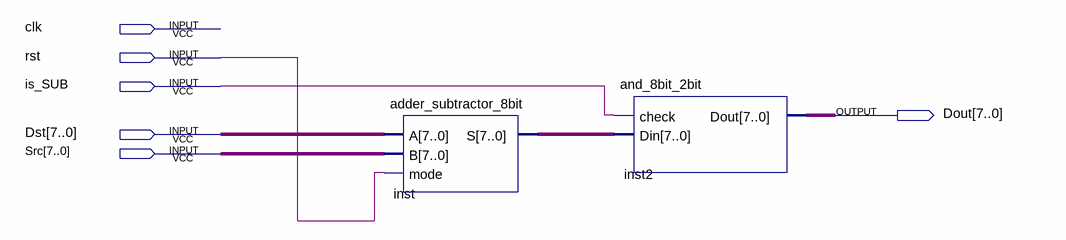
[diagram p0: schematic sheet]
// Quartus schematic sub_module.bdf as structural Verilog: 2 symbols, 6 pins
module sub_module (
  input  clk,
  input  rst,
  input  is_SUB,
  input  [7:0] Dst,
  input  [7:0] Src,
  output [7:0] Dout
);

  wire [7:0] inst_s;

  adder_subtractor_8bit inst (.A(Dst), .B(Src), .mode(rst), .S(inst_s));
  and_8bit_2bit inst2 (.check(is_SUB), .Din(inst_s), .Dout(Dout));
endmodule
